# EAGLE schematic ftPwrDrive_2v9a (EAGLE 9.0.0)
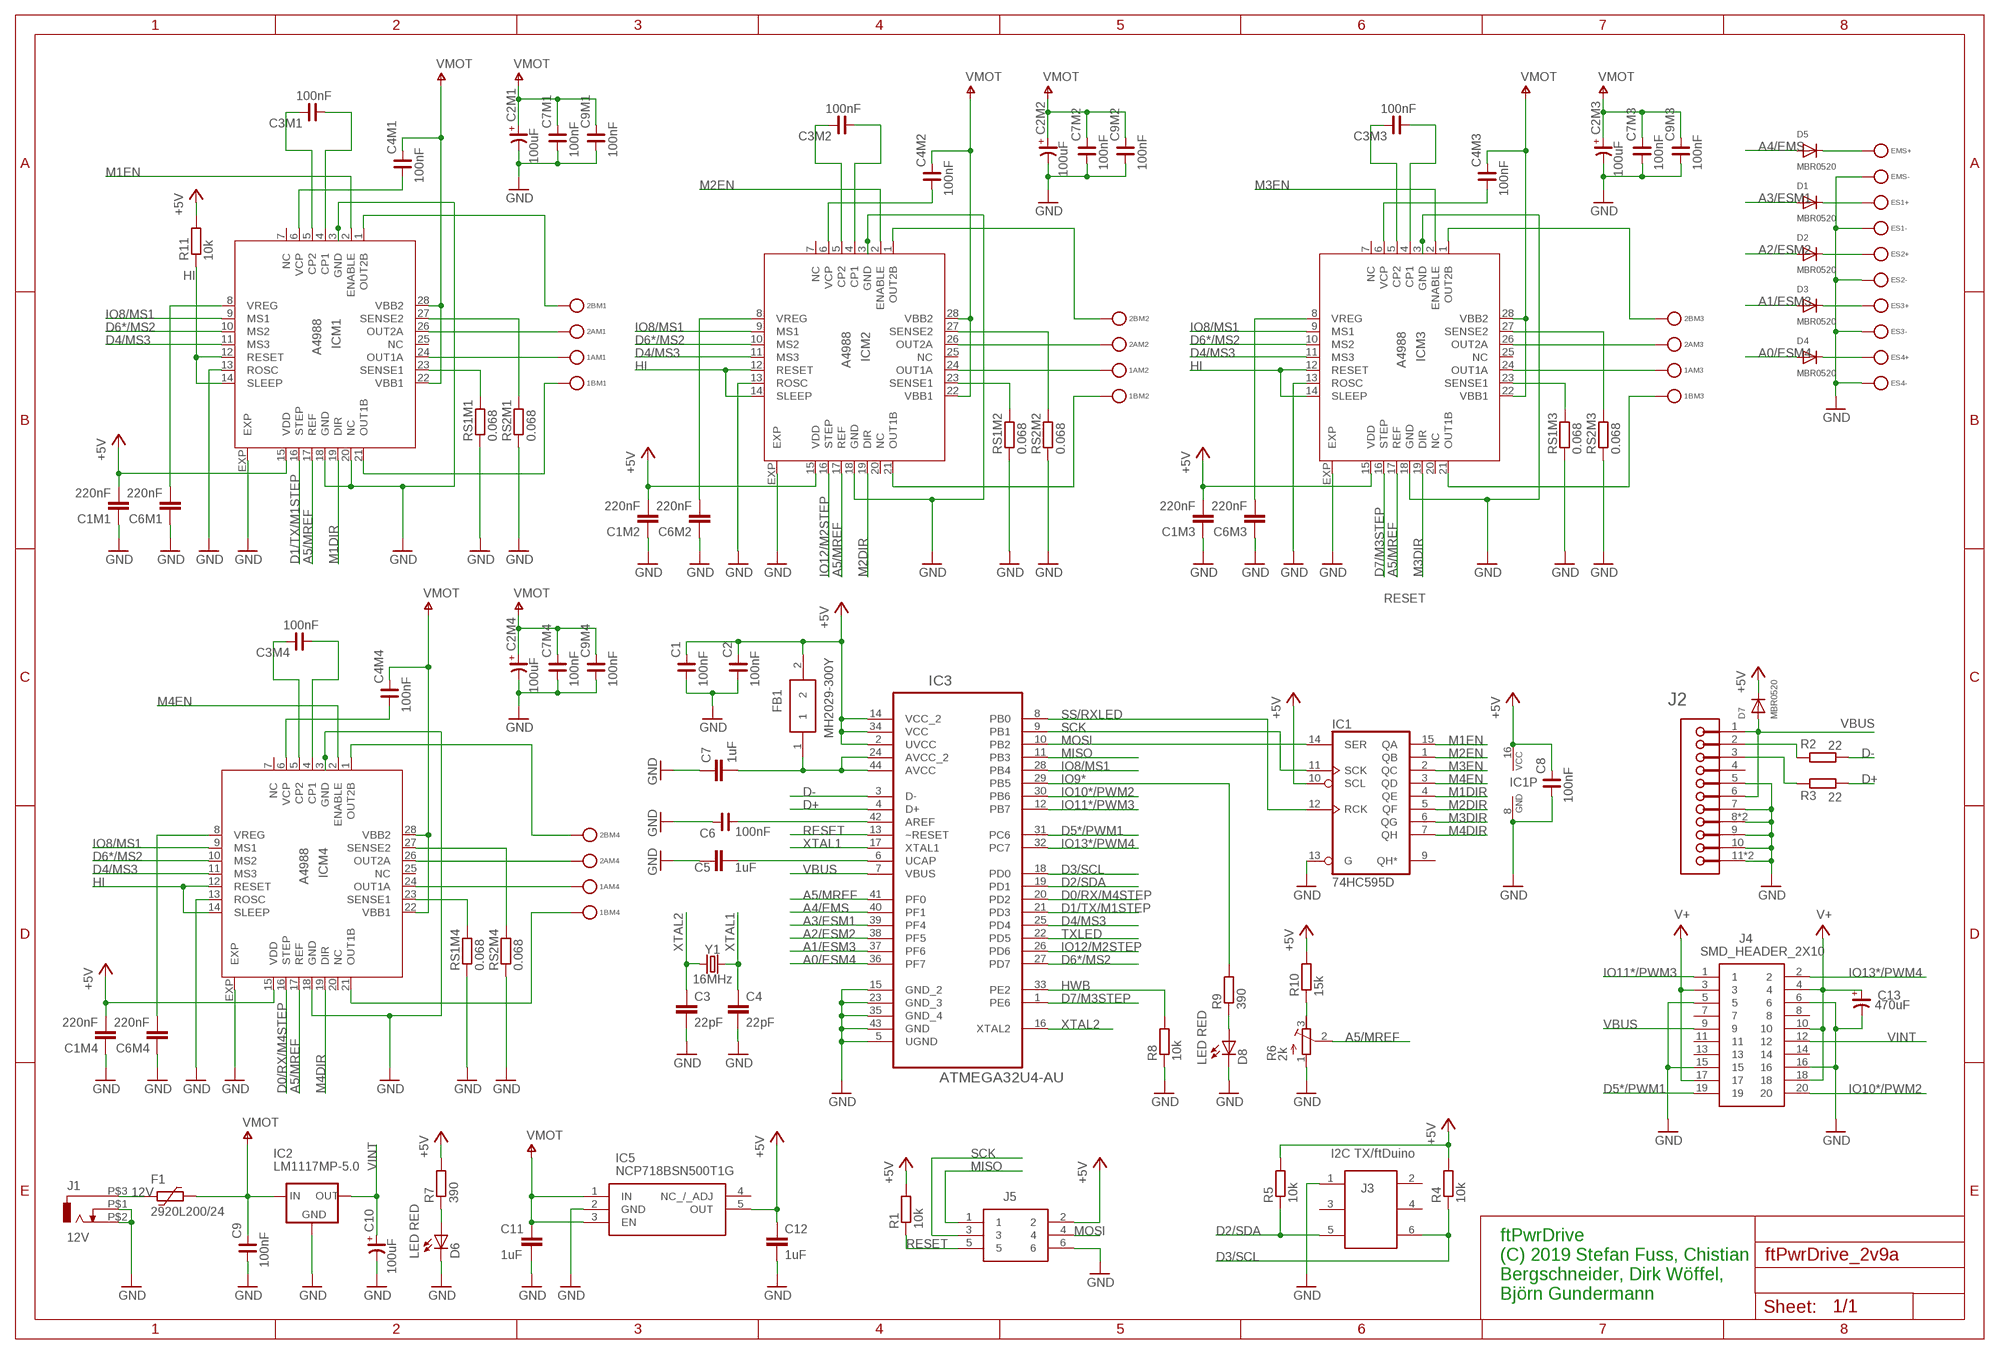
[diagram p0: schematic, sheet 1]

## Parts
1AM1  BUNDHUELSE2  [BUNDHUELSE]
1AM2  BUNDHUELSE2  [BUNDHUELSE]
1AM3  BUNDHUELSE2  [BUNDHUELSE]
1AM4  BUNDHUELSE2  [BUNDHUELSE]
1BM1  BUNDHUELSE2  [BUNDHUELSE]
1BM2  BUNDHUELSE2  [BUNDHUELSE]
1BM3  BUNDHUELSE2  [BUNDHUELSE]
1BM4  BUNDHUELSE2  [BUNDHUELSE]
2AM1  BUNDHUELSE2  [BUNDHUELSE]
2AM2  BUNDHUELSE2  [BUNDHUELSE]
2AM3  BUNDHUELSE2  [BUNDHUELSE]
2AM4  BUNDHUELSE2  [BUNDHUELSE]
2BM1  BUNDHUELSE2  [BUNDHUELSE]
2BM2  BUNDHUELSE2  [BUNDHUELSE]
2BM3  BUNDHUELSE2  [BUNDHUELSE]
2BM4  BUNDHUELSE2  [BUNDHUELSE]
C1  100nF  C_0603  [C0603]
C1M1  220nF  C-EUC0603K  [C0603K]
C1M2  220nF  C-EUC0603K  [C0603K]
C1M3  220nF  C-EUC0603K  [C0603K]
C1M4  220nF  C-EUC0603K  [C0603K]
C2  100nF  C_0603  [C0603]
C2M1  100uF  CP_SV-D  [CSV-D]
C2M2  100uF  CP_SV-D  [CSV-D]
C2M3  100uF  CP_SV-D  [CSV-D]
C2M4  100uF  CP_SV-D  [CSV-D]
C3  22pF  C-EUC0603K  [C0603K]
C3M1  100nF  C_0603  [C0603]
C3M2  100nF  C_0603  [C0603]
C3M3  100nF  C_0603  [C0603]
C3M4  100nF  C_0603  [C0603]
C4  22pF  C-EUC0603K  [C0603K]
C4M1  100nF  C_0603  [C0603]
C4M2  100nF  C_0603  [C0603]
C4M3  100nF  C_0603  [C0603]
C4M4  100nF  C_0603  [C0603]
C5  1uF  C-EUC0603K  [C0603K]
C6  100nF  C_0603  [C0603]
C6M1  220nF  C-EUC0603K  [C0603K]
C6M2  220nF  C-EUC0603K  [C0603K]
C6M3  220nF  C-EUC0603K  [C0603K]
C6M4  220nF  C-EUC0603K  [C0603K]
C7  1uF  C-EUC0603K  [C0603K]
C7M1  100nF  C_0603  [C0603]
C7M2  100nF  C_0603  [C0603]
C7M3  100nF  C_0603  [C0603]
C7M4  100nF  C_0603  [C0603]
C8  100nF  C_0603  [C0603]
C9  100nF  C_0603  [C0603]
C9M1  100nF  C_0603  [C0603]
C9M2  100nF  C_0603  [C0603]
C9M3  100nF  C_0603  [C0603]
C9M4  100nF  C_0603  [C0603]
C10  100uF  CP_SV-D  [CSV-D]
C11  1uF  C-EUC0603K  [C0603K]
C12  1uF  C-EUC0603K  [C0603K]
C13  470uF  CP_SV-E/F  [CSV-E/F]
D1  MBR0520  DIODESOD-123  [SOD-123]
D2  MBR0520  DIODESOD-123  [SOD-123]
D3  MBR0520  DIODESOD-123  [SOD-123]
D4  MBR0520  DIODESOD-123  [SOD-123]
D5  MBR0520  DIODESOD-123  [SOD-123]
D6  LED RED  LEDCHIP-LED0805  [CHIP-LED0805]
D7  MBR0520  DIODESOD-123  [SOD-123]
D8  LED RED  LEDCHIP-LED0805  [CHIP-LED0805]
EMS+  BUNDHUELSE2  [BUNDHUELSE]
EMS-  BUNDHUELSE2  [BUNDHUELSE]
ES1+  BUNDHUELSE2  [BUNDHUELSE]
ES1-  BUNDHUELSE2  [BUNDHUELSE]
ES2+  BUNDHUELSE2  [BUNDHUELSE]
ES2-  BUNDHUELSE2  [BUNDHUELSE]
ES3+  BUNDHUELSE2  [BUNDHUELSE]
ES3-  BUNDHUELSE2  [BUNDHUELSE]
ES4+  BUNDHUELSE2  [BUNDHUELSE]
ES4-  BUNDHUELSE2  [BUNDHUELSE]
F1  2920L200/24  [2920L]
FB1  MH2029-300Y  [BEADC2016X130N]
IC1  74HC595D  [SO16]
IC2  LM1117MP-5.0  [SOT223]
IC3  ATMEGA32U4-AU  [QFP80P1200X1200X120-44N]
IC5  NCP718BSN500T1G  [SOT95P280X100-5N]
ICM1  A4988  A4983  [QFN28ET]
ICM2  A4988  A4983  [QFN28ET]
ICM3  A4988  A4983  [QFN28ET]
ICM4  A4988  A4983  [QFN28ET]
J1  12V  RASM7X2  [RASM7X2]
J2  AMPHENOL_10118194-0001LFAMPHENOL_10118194-0001LF_0_0  [AMPHENOL_10118194-0001LF_0]
J3  I2C TX/ftDuino  SMTHEADER06  [SMTHEADER06]
J4  SMD_HEADER_2X10  [SMD_HEADER_2X10]
J5  SMD_HEADER_2X03  [SMD_HEADER_2X03]
R1  10k  R-EU_R0603  [R0603]
R2  22  R-EU_R0603  [R0603]
R3  22  R-EU_R0603  [R0603]
R4  10k  R-EU_R0603  [R0603]
R5  10k  R-EU_R0603  [R0603]
R6  2k  R-TRIMM4G/J  [RTRIM4G/J]
R7  390  R-EU_R0603  [R0603]
R8  10k  R-EU_R0603  [R0603]
R9  390  R-EU_R0603  [R0603]
R10  15k  R-EU_R0603  [R0603]
R11  10k  R-EU_R0603  [R0603]
RS1M1  0.068  R-EU_R1206  [R1206]
RS1M2  0.068  R-EU_R1206  [R1206]
RS1M3  0.068  R-EU_R1206  [R1206]
RS1M4  0.068  R-EU_R1206  [R1206]
RS2M1  0.068  R-EU_R1206  [R1206]
RS2M2  0.068  R-EU_R1206  [R1206]
RS2M3  0.068  R-EU_R1206  [R1206]
RS2M4  0.068  R-EU_R1206  [R1206]
Y1  16MHz  CRYSTALSMD-HC49UP  [HC49UP]

## Nets
1AM1: 1AM1.P$1(TESTPOINT) ICM1.24(OUT1A)
1AM2: 1AM2.P$1(TESTPOINT) ICM2.24(OUT1A)
1AM3: 1AM3.P$1(TESTPOINT) ICM3.24(OUT1A)
1AM4: 1AM4.P$1(TESTPOINT) ICM4.24(OUT1A)
1BM1: 1BM1.P$1(TESTPOINT) ICM1.21(OUT1B)
1BM2: 1BM2.P$1(TESTPOINT) ICM2.21(OUT1B)
1BM3: 1BM3.P$1(TESTPOINT) ICM3.21(OUT1B)
1BM4: 1BM4.P$1(TESTPOINT) ICM4.21(OUT1B)
2AM1: 2AM1.P$1(TESTPOINT) ICM1.26(OUT2A)
2AM2: 2AM2.P$1(TESTPOINT) ICM2.26(OUT2A)
2AM3: 2AM3.P$1(TESTPOINT) ICM3.26(OUT2A)
2AM4: 2AM4.P$1(TESTPOINT) ICM4.26(OUT2A)
2BM1: 2BM1.P$1(TESTPOINT) ICM1.1(OUT2B)
2BM2: 2BM2.P$1(TESTPOINT) ICM2.1(OUT2B)
2BM3: 2BM3.P$1(TESTPOINT) ICM3.1(OUT2B)
2BM4: 2BM4.P$1(TESTPOINT) ICM4.1(OUT2B)
12V: F1.2 J1.P$3
+5V [usbvcc]: C1.2 C1M1.2 C1M2.2 C1M3.2 C1M4.2 C2.2 C8.2 C12.1 D7.C FB1.2 IC1.10(SCL) IC1.16(VCC) IC3.2(UVCC) IC3.14(VCC_2) IC3.34(VCC) IC5.5(OUT) ICM1.15(VDD) ICM2.15(VDD) ICM3.15(VDD) ICM4.15(VDD) J5.2 R1.2 R4.2 R5.2 R7.2 R10.2 R11.2
A0/ESM4: D4.A IC3.36(PF7)
A1/ESM3: D3.A IC3.37(PF6)
A2/ESM2: D2.A IC3.38(PF5)
A3/ESM1: D1.A IC3.39(PF4)
A4/EMS: D5.A IC3.40(PF1)
A5/MREF: IC3.41(PF0) ICM1.17(REF) ICM2.17(REF) ICM3.17(REF) ICM4.17(REF) R6.2(S)
D0/RX/M4STEP: IC3.20(PD2) ICM4.16(STEP)
D1/TX/M1STEP: IC3.21(PD3) ICM1.16(STEP)
D2/SDA: IC3.19(PD1) J3.5 R5.1
D3/SCL: IC3.18(PD0) J3.6 R4.1
D4/MS3: IC3.25(PD4) ICM1.11(MS3) ICM2.11(MS3) ICM3.11(MS3) ICM4.11(MS3)
D5*/PWM1: IC3.31(PC6) J4.19
D6*/MS2: IC3.27(PD7) ICM1.10(MS2) ICM2.10(MS2) ICM3.10(MS2) ICM4.10(MS2)
D7/M3STEP: IC3.1(PE6) ICM3.16(STEP)
D+: IC3.4(D+) R3.1
D-: IC3.3(D-) R2.1
ES1+: D1.C ES1+.P$1(TESTPOINT)
ES1+1: D5.C EMS+.P$1(TESTPOINT)
ES2+: D2.C ES2+.P$1(TESTPOINT)
ES3+: D3.C ES3+.P$1(TESTPOINT)
ES4+: D4.C ES4+.P$1(TESTPOINT)
GND [gnd]: C1.1 C1M1.1 C1M2.1 C1M3.1 C1M4.1 C2.1 C2M1.- C2M2.- C2M3.- C2M4.- C3.2 C4.2 C5.1 C6.1 C6M1.1 C6M2.1 C6M3.1 C6M4.1 C7.1 C7M1.1 C7M2.1 C7M3.1 C7M4.1 C8.1 C9.1 C9M1.1 C9M2.1 C9M3.1 C9M4.1 C10.- C11.1 C12.2 C13.- D6.C D8.C EMS-.P$1(TESTPOINT) ES1-.P$1(TESTPOINT) ES2-.P$1(TESTPOINT) ES3-.P$1(TESTPOINT) ES4-.P$1(TESTPOINT) IC1.8(GND) IC1.13(G) IC2.1(GND) IC3.5(UGND) IC3.15(GND_2) IC3.23(GND_3) IC3.35(GND_4) IC3.43(GND) IC5.2(GND) ICM1.3(GND) ICM1.13(ROSC) ICM1.18(GND) ICM1.20(NC) ICM1.EXP ICM2.3(GND) ICM2.13(ROSC) ICM2.18(GND) ICM2.EXP ICM3.3(GND) ICM3.13(ROSC) ICM3.18(GND) ICM3.EXP ICM4.3(GND) ICM4.13(ROSC) ICM4.18(GND) ICM4.EXP J1.P$1 J1.P$2 J2.5 J2.7(MNT_2) J2.8(MNT_3) J2.8-2(MNT_3) J2.9(MNT_4) J2.10(MNT_5) J2.11(MNT_6) J2.11-2(MNT_6) J3.1 J4.5 J4.6 J4.15 J4.16 J5.6 R6.1(A) R8.1 RS1M1.1 RS1M2.1 RS1M3.1 RS1M4.1 RS2M1.1 RS2M2.1 RS2M3.1 RS2M4.1
HI: ICM1.12(RESET) ICM1.14(SLEEP) ICM2.12(RESET) ICM2.14(SLEEP) ICM3.12(RESET) ICM3.14(SLEEP) ICM4.12(RESET) ICM4.14(SLEEP) R11.1
HWB: IC3.33(PE2) R8.2
IO8/MS1: IC3.28(PB4) ICM1.9(MS1) ICM2.9(MS1) ICM3.9(MS1) ICM4.9(MS1)
IO9*: IC3.29(PB5) R9.2
IO10*/PWM2: IC3.30(PB6) J4.20
IO11*/PWM3: IC3.12(PB7) J4.1
IO12/M2STEP: IC3.26(PD6) ICM2.16(STEP)
IO13*/PWM4: IC3.32(PC7) J4.2
M1DIR: IC1.4(QE) ICM1.19(DIR)
M1EN: IC1.15(QA) ICM1.2(ENABLE)
M2DIR: IC1.5(QF) ICM2.19(DIR)
M2EN: IC1.1(QB) ICM2.2(ENABLE)
M3DIR: IC1.6(QG) ICM3.19(DIR)
M3EN: IC1.2(QC) ICM3.2(ENABLE)
M4DIR: IC1.7(QH) ICM4.19(DIR)
M4EN: IC1.3(QD) ICM4.2(ENABLE)
MISO: IC3.11(PB3) J5.1
MOSI: IC1.14(SER) IC3.10(PB2) J5.4
N$1: J2.2 R2.2
N$2: J2.3 R3.2
N$4: D8.A R9.1
N$6: R6.3(E) R10.1
N$10: C5.2 IC3.6(UCAP)
N$23: C7.2 FB1.1 IC3.24(AVCC_2) IC3.44(AVCC)
N$28: C6.2 IC3.42(AREF)
N$99: D6.A R7.1
RESET: IC3.13(~RESET) J5.5 R1.1
SCK: IC1.11(SCK) IC3.9(PB1) J5.3
SS/RXLED: IC1.12(RCK) IC3.8(PB0)
TXLED: IC3.22(PD5)
V+: C13.+ J4.3 J4.4 J4.10 J4.17 J4.18
VBUS: D7.A IC3.7(VBUS) J2.1 J2.6(MNT_1) J4.9
VINT: C10.+ IC2.2(OUT) IC2.4(OUT) J4.12
VMOT: C2M1.+ C2M2.+ C2M3.+ C2M4.+ C4M1.2 C4M2.2 C4M3.2 C4M4.2 C7M1.2 C7M2.2 C7M3.2 C7M4.2 C9.2 C9M1.2 C9M2.2 C9M3.2 C9M4.2 C11.2 F1.1 IC2.3(IN) IC5.1(IN) IC5.3(EN) ICM1.22(VBB1) ICM1.28(VBB2) ICM2.22(VBB1) ICM2.28(VBB2) ICM3.22(VBB1) ICM3.28(VBB2) ICM4.22(VBB1) ICM4.28(VBB2)
XCP1: C3M1.1 ICM1.4(CP1)
XCP2: C3M1.2 ICM1.5(CP2)
XCP5: C3M2.1 ICM2.4(CP1)
XCP6: C3M2.2 ICM2.5(CP2)
XCP7: C3M3.1 ICM3.4(CP1)
XCP8: C3M3.2 ICM3.5(CP2)
XCP9: C3M4.1 ICM4.4(CP1)
XCP10: C3M4.2 ICM4.5(CP2)
XSENSE1: ICM1.23(SENSE1) RS1M1.2
XSENSE2: ICM1.27(SENSE2) RS2M1.2
XSENSE5: ICM2.27(SENSE2) RS2M2.2
XSENSE6: ICM2.23(SENSE1) RS1M2.2
XSENSE7: ICM3.27(SENSE2) RS2M3.2
XSENSE8: ICM3.23(SENSE1) RS1M3.2
XSENSE9: ICM4.27(SENSE2) RS2M4.2
XSENSE10: ICM4.23(SENSE1) RS1M4.2
XTAL1: C4.1 IC3.17(XTAL1) Y1.2
XTAL2: C3.1 IC3.16(XTAL2) Y1.1
XVCP: C4M1.1 ICM1.6(VCP)
XVCP2: C4M2.1 ICM2.6(VCP)
XVCP3: C4M3.1 ICM3.6(VCP)
XVCP4: C4M4.1 ICM4.6(VCP)
XVREG: C6M1.2 ICM1.8(VREG)
XVREG2: C6M2.2 ICM2.8(VREG)
XVREG3: C6M3.2 ICM3.8(VREG)
XVREG4: C6M4.2 ICM4.8(VREG)
Unconnected: IC1.9(QH*) IC5.4(NC_/_ADJ) ICM1.7(NC) ICM1.25(NC) ICM2.7(NC) ICM2.20(NC) ICM2.25(NC) ICM3.7(NC) ICM3.20(NC) ICM3.25(NC) ICM4.7(NC) ICM4.20(NC) ICM4.25(NC) J2.4 J3.2 J3.3 J3.4 J4.7 J4.8 J4.11 J4.13 J4.14

## Notes on the sheet
- ftPwrDrive
  (C) 2019 Stefan Fuss, Chistian
  Bergschneider, Dirk Wöffel,
  Björn Gundermann

## Library data of the parts
1AM1-1AM4 1BM1-1BM4 2AM1-2AM4 2BM1-2BM4 EMS+ EMS- ES1+ ES1- ES2+ ES2- ES3+ ES3- ES4+ ES4- = sflib:BUNDHUELSE2
C1 C2 C3M1-C3M4 C4M1-C4M4 C6 C7M1-C7M4 C8 C9 C9M1-C9M4 = rc-master-smd:C_: NON-POLARIZED CAP
C1M1-C1M4 C3-C5 C6M1-C6M4 C7 C11 C12 = rcl:C-EU: CAPACITOR, European symbol; SPICEPREFIX: C
C2M1-C2M4 C10 C13 = rc-master-smd:CP_: POLARIZED CAP
D1-D5 D7 = adafruit:DIODE: Diode SMADIODE - SMA Surface Mount Package 20V 1A Schottky Diode Digikey: 641-1014-6-ND DO-1N4148 - Through Hole Small Current Diode SOD-123 20V 1 A (.5mV Vf) Schottky Diode - Digikey: MBRX120TPMSCT-ND SOD-323 10V 570mA (.38mV Vf, 3ns) Schottky Diode - Digikey: ZLLS410CT-ND SOD-523 30V 30mA Schottky Diode (RB751S-40TE61) - Digikey: RB751S-40TE61CT-ND SOT23-R/W - SOT23 Package (R = Solder Paste/Reflow Ovens, W = Hand-Soldering) BAT54Film 40V 300mA - Digikey: 497-7162-1-ND
D6 D8 = led:LED: LED OSRAM: - CHIPLED LG R971, LG N971, LY N971, LG Q971, LY Q971, LO R971, LY R971 LH N974, LH R974 LS Q976, LO Q976, LY Q976 LO Q996 - Hyper CHIPLED LW Q18S LB Q993, LB Q99A, LB R99A - SideLED LS A670, LO A670, LY A670, LG A670, LP A670 LB A673, LV A673, LT A673, LW A673 LH A674 LY A675 LS A676, LA A676, LO A676, LY A676, LW A676 LS A679, LY A679, LG A679 - Hyper Micro SIDELED® LS Y876, LA Y876, LO Y876, LY Y876 LT Y87S - SmartLED LW L88C, LW L88S LB L89C, LB L89S, LG L890 LS L89K, LO L89K, LY L89K LS L896, LA L896, LO L896, LY L896 - TOPLED LS T670, LO T670, LY T670, LG T670, LP T670 LSG T670, LSP T670, LSY T670, LOP T670, LYG T670 LG T671, LOG T671, LSG T671 LB T673, LV T673, LT T673, LW T673 LH T674 LS T676, LA T676, LO T676, LY T676, LB T676, LH T676, LSB T676, LW T676 LB T67C, LV T67C, LT T67C, LS T67K, LO T67K, LY T67K, LW E67C LS E67B, LA E67B, LO E67B, LY E67B, LB E67C, LV E67C, LT E67C LW T67C LS T679, LY T679, LG T679 LS T770, LO T770, LY T770, LG T770, LP T770 LB T773, LV T773, LT T773, LW T773 LH T774 LS E675, LA E675, LY E675, LS T675 LS T776, LA T776, LO T776, LY T776, LB T776 LHGB T686 LT T68C, LB T68C - Hyper Mini TOPLED® LB M676 - Mini TOPLED Santana® LG M470 LS M47K, LO M47K, LY M47K Source: http://www.osram.convergy.de LUXEON: - LUMILED® LXK2-PW12-R00, LXK2-PW12-S00, LXK2-PW14-U00, LXK2-PW14-V00 LXK2-PM12-R00, LXK2-PM12-S00, LXK2-PM14-U00 LXK2-PE12-Q00, LXK2-PE12-R00, LXK2-PE12-S00, LXK2-PE14-T00, LXK2-PE14-U00 LXK2-PB12-K00, LXK2-PB12-L00, LXK2-PB12-M00, LXK2-PB14-N00, LXK2-PB14-P00, LXK2-PB14-Q00 LXK2-PR12-L00, LXK2-PR12-M00, LXK2-PR14-Q00, LXK2-PR14-R00 LXK2-PD12-Q00, LXK2-PD12-R00, LXK2-PD12-S00 LXK2-PH12-R00, LXK2-PH12-S00 LXK2-PL12-P00, LXK2-PL12-Q00, LXK2-PL12-R00 Source: www.luxeon.com KINGBRIGHT: KA-3528ASYC Source: www.kingbright.com
F1 = polyfuse-smd_20:?: Polyfuse Resettable PTC Source: http://www.littelfuse.com/products/resettable-ptcs.aspx; MF: Littelfuse; MPN: 2920L200/24; OC_FARNELL: 2309127; OC_NEWARK: 05M2797
FB1 = MH2029-300Y:MH2029-300Y: EMI Filter Beads, Chips & Arrays Impedance 30ohms IDC 3.0 Source: Datasheet <http://www.mouser.com/ds/2/54/h-777565.pdf>; ALLIED_NUMBER: 71024701; ALLIED_PRICE-STOCK: https://www.alliedelec.com/bourns-mh2029-300y/71024701/; DESCRIPTION: EMI Filter Beads, Chips & Arrays Impedance 30ohms IDC 3.0; HEIGHT: 1.3mm; MANUFACTURER_NAME: Bourns; MANUFACTURER_PART_NUMBER: MH2029-300Y; MOUSER_PART_NUMBER: 652-MH2029-300Y; MOUSER_PRICE-STOCK: https://www.mouser.com/Search/Refine.aspx?Keyword=652-MH2029-300Y; RS_PART_NUMBER: 1814464; RS_PRICE-STOCK: http://uk.rs-online.com/web/p/products/1814464
IC1 = 74xx-eu:74*595: 8-bit SHIFT REGISTER, output latch
IC2 = lm1117_10:LM1117?-*: 800mA Low-Dropout Linear Regulator Source: http://www.ti.com/lit/ds/symlink/lm1117-n.pdf; MF: Texas Instruments; MPN: LM1117MP-5.0; OC_FARNELL: 9778209; OC_NEWARK: 28X3417
IC3 = ATMEGA32U4-AU:ATMEGA32U4-AU: 8-bit Microcontroller with ISP Flash and USB Controller; AVAILABILITY: Unavailable; DESCRIPTION: MCU 8-bit ATmega AVR RISC 32KB Flash 3.3V/5V 44-Pin TQFP; MF: Microchip; MP: ATMEGA32U4-AU; PACKAGE: TQFP-44 Microchip; PRICE: None
IC5 = NCP718BSN500T1G:NCP718BSN500T1G: 300 MA LOW IQ, WIDE INPUT Source: Datasheet <http://www.onsemi.com/pub/Collateral/NCP718-D.PDF>; DESCRIPTION: 300 MA LOW IQ, WIDE INPUT; HEIGHT: 1mm; MANUFACTURER_NAME: ON Semiconductor; MANUFACTURER_PART_NUMBER: NCP718BSN500T1G; MOUSER_PART_NUMBER: 863-NCP718BSN500T1G; MOUSER_PRICE-STOCK: https://www.mouser.com/Search/Refine.aspx?Keyword=863-NCP718BSN500T1G
ICM1-ICM4 = allegro:A4983: DMOS Microstepping Driver with Translator Auto generated by make-symbol-device-package-bsdl.ulp Rev. 32 Source: http://www.allegromicro.com/en/Products/Part_Numbers/4983/4983.pdf; MPN: A4983SETTR-T; OC_FARNELL: 1688956; OC_NEWARK: 39M6763
J1 = RASM7X2:RASM7X2: DC POWER JACK; OC_FARNELL: unknown; OC_NEWARK: unknown
J2 = Amphenol - 10118194-0001LF:AMPHENOL_10118194-0001LF: CONN USB MICRO B RECPT SMT R/A; AC_DURABILITY_(MATING_CYCLES): 10000 Mating Cycles; CENTROID_NOT_SPECIFIED: No; CURRENT_RATING: 1.8A per contact; DATASHEET: http://portal.fciconnect.com/Comergent//fci/drawing/10118194.pdf; DIGIKEY_DESCRIPTION: CONN USB MICRO B RECPT SMT R/A; DIGIKEY_PART_NUMBER: 609-4618-1-ND; IMPORTED_FROM: octopart; IS_FEMALE: yes; LEAD_FREE: yes; MANUFACTURER_PRODUCT_PAGE: http://www.amphenol-icc.com/micro-usb-101181940001lf.html; MF: Amphenol; MOUSER_PART_NUMBER: 649-10118194-0001LF; MPN: 10118194-0001LF; PACKAGE: CONN_USB; PREFIX: J; PRODUCT_SPECIFICATION: http://www.amphenol-icc.com/media/wysiwyg/files/documentation/gs-12-641.pdf; RESISTANCE_(CONTACT)_INITIAL: 30 m-Ω max|After test delta: 10 m-Ω max change; RESISTANCE_(INSULATION)_INITIAL: 1000 M-Ω Min.|After test: 100 M-Ω Min.; ROHS: yes; TEMPERATURE_RANGE_HIGH: +80°C; TEMPERATURE_RANGE_LOW: -30°C; VOLTAGE_RATING: 100V
J3 = sflib:SMTHEADER06
J4 = sfu_smd_header:SMD_HEADER_2X10
J5 = sfu_smd_header:SMD_HEADER_2X03
R1-R5 R8 R10 R11 RS1M1-RS1M4 RS2M1-RS2M4 = rcl:R-EU_: RESISTOR, European symbol; SPICEPREFIX: R
R6 = rcl:R-TRIMM: Trimm resistor; SPICEMODEL: X; SPICEPREFIXL: POT
R7 R9 = resistor:R-EU_: RESISTOR, European symbol
Y1 = SparkFun-Clocks:CRYSTAL: Crystals (Generic) These are passive quartz crystals, which can be used as a clock source for a microcontroller. Crystal's are two-terminal devices. They require external "load" capacitors to generate an oscillating signal.

## Net classes
2 gnd: width 0.254 mm, drill 0.61 mm, clearance 0.254 mm
3 usbvcc: width 0.254 mm, drill 0.61 mm, clearance 0.254 mm
4 aref: width 0.254 mm, drill 0.61 mm, clearance 0.254 mm